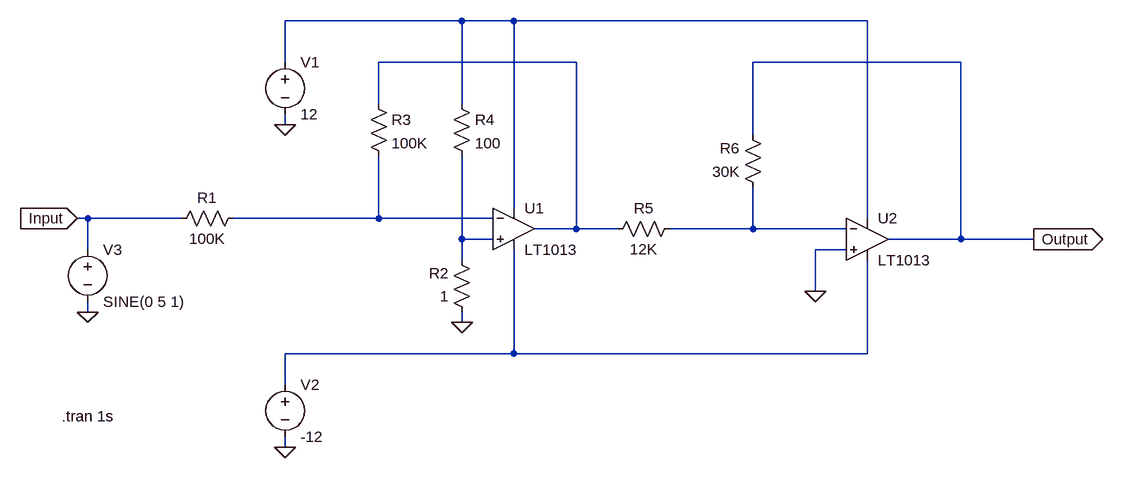
[diagram p0: schematic signalamp.asc]
signalamp.asc, the LTspice schematic file:
Version 4
SHEET 1 1132 680
WIRE 112 -176 -160 -176
WIRE 192 -176 112 -176
WIRE 736 -176 192 -176
WIRE -160 -112 -160 -176
WIRE 288 -112 -16 -112
WIRE 880 -112 560 -112
WIRE -16 -48 -16 -112
WIRE 112 -48 112 -176
WIRE -160 -16 -160 -32
WIRE 560 0 560 -112
WIRE 192 112 192 -176
WIRE -464 128 -480 128
WIRE -320 128 -464 128
WIRE -16 128 -16 32
WIRE -16 128 -240 128
WIRE 160 128 -16 128
WIRE 736 128 736 -176
WIRE 288 144 288 -112
WIRE 288 144 224 144
WIRE 352 144 288 144
WIRE 560 144 560 80
WIRE 560 144 432 144
WIRE 704 144 560 144
WIRE 112 160 112 32
WIRE 160 160 112 160
WIRE 880 160 880 -112
WIRE 880 160 768 160
WIRE 992 160 880 160
WIRE -464 176 -464 128
WIRE 704 176 656 176
WIRE 112 192 112 160
WIRE 656 240 656 176
WIRE -464 272 -464 256
WIRE 112 288 112 272
WIRE 192 336 192 176
WIRE 192 336 -160 336
WIRE 736 336 736 192
WIRE 736 336 192 336
WIRE -160 384 -160 336
WIRE -160 480 -160 464
FLAG -464 272 0
FLAG -160 -16 0
FLAG -160 480 0
FLAG -480 128 Input
IOPIN -480 128 In
FLAG 112 288 0
FLAG 656 240 0
FLAG 992 160 Output
IOPIN 992 160 Out
SYMBOL voltage -160 -128 R0
WINDOW 123 0 0 Left 0
WINDOW 39 0 0 Left 0
SYMATTR InstName V1
SYMATTR Value 12
SYMBOL voltage -160 368 R0
WINDOW 123 0 0 Left 0
WINDOW 39 0 0 Left 0
SYMATTR InstName V2
SYMATTR Value -12
SYMBOL voltage -464 160 R0
WINDOW 123 0 0 Left 0
WINDOW 39 0 0 Left 0
SYMATTR InstName V3
SYMATTR Value SINE(0 5 1)
SYMBOL OpAmps\\LT1013 192 80 R0
SYMATTR InstName U1
SYMBOL OpAmps\\LT1013 736 96 R0
SYMATTR InstName U2
SYMBOL res -224 112 R90
WINDOW 0 0 56 VBottom 2
WINDOW 3 32 56 VTop 2
SYMATTR InstName R1
SYMATTR Value 100K
SYMBOL res 128 288 R180
WINDOW 0 36 76 Left 2
WINDOW 3 36 40 Left 2
SYMATTR InstName R2
SYMATTR Value 1
SYMBOL res -32 -64 R0
SYMATTR InstName R3
SYMATTR Value 100K
SYMBOL res 96 -64 R0
SYMATTR InstName R4
SYMATTR Value 100
SYMBOL res 448 128 R90
WINDOW 0 0 56 VBottom 2
WINDOW 3 32 56 VTop 2
SYMATTR InstName R5
SYMATTR Value 12K
SYMBOL res 576 96 R180
WINDOW 0 36 76 Left 2
WINDOW 3 36 40 Left 2
SYMATTR InstName R6
SYMATTR Value 30K
TEXT -504 432 Left 2 !.tran 1s

The netlist it stands for:
* signalamp.asc
V1 N001 0 12
V2 N006 0 -12
V3 Input 0 SINE(0 5 1)
XU1 N005 N003 N001 N006 N002 LT1013  ; pins In+ In- V+ V- OUT
XU2 0 N004 N001 N006 Output LT1013  ; pins In+ In- V+ V- OUT
R1 N003 Input 100K
R2 0 N005 1
R3 N002 N003 100K
R4 N001 N005 100
R5 N004 N002 12K
R6 N004 Output 30K
.tran 1s
.lib LTC.lib
.backanno
.end